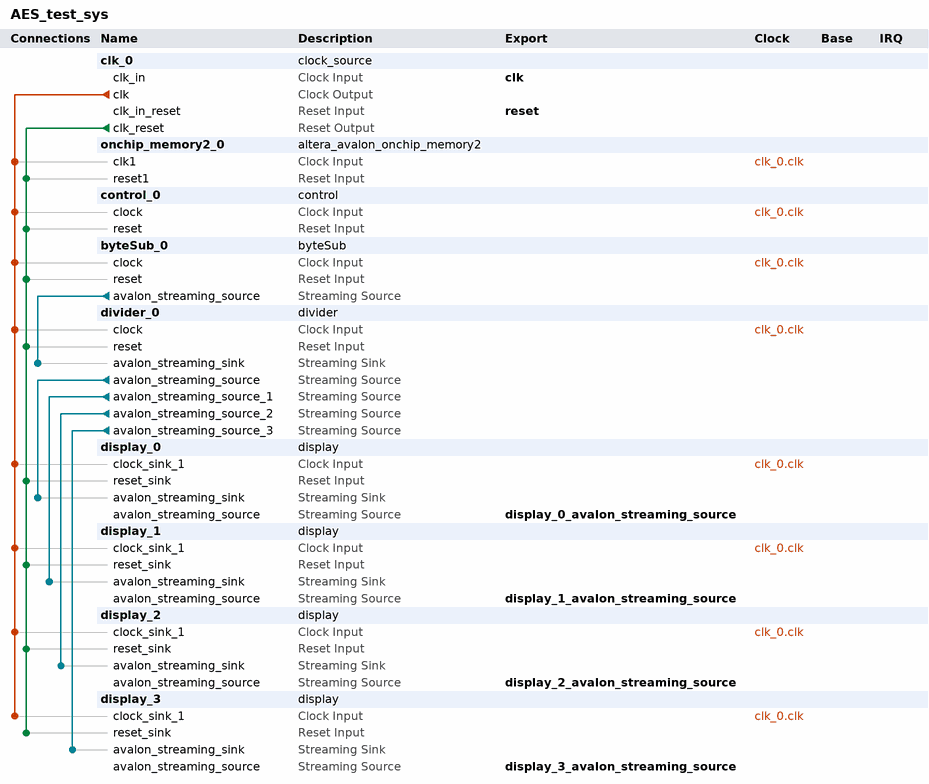
[diagram p0: system contents]
# Platform Designer (Qsys) system AES_test_sys, MAX 10 10M50DAF484C7G
# Parameters at their usual value, and those the tool derives, are not listed.
package require -exact qsys 18.0
create_system AES_test_sys
set_project_property DEVICE_FAMILY {MAX 10}
set_project_property DEVICE 10M50DAF484C7G

add_instance clk_0 clock_source 18.0
set_instance_parameter_value clk_0 clockFrequency 50000000

add_instance onchip_memory2_0 altera_avalon_onchip_memory2 18.0
set_instance_parameter_value onchip_memory2_0 dataWidth 128
set_instance_parameter_value onchip_memory2_0 dualPort false
set_instance_parameter_value onchip_memory2_0 initMemContent true
set_instance_parameter_value onchip_memory2_0 initializationFileName C:/Users/test/Desktop/GitLab/AES/init_file.hex
set_instance_parameter_value onchip_memory2_0 memorySize 1024
set_instance_parameter_value onchip_memory2_0 readDuringWriteMode OLD_DATA
set_instance_parameter_value onchip_memory2_0 singleClockOperation true
set_instance_parameter_value onchip_memory2_0 useNonDefaultInitFile true
set_instance_parameter_value onchip_memory2_0 writable false

add_instance control_0 control 1.0

add_instance byteSub_0 byteSub 1.0

add_instance divider_0 divider 1.0

add_instance display_0 display 1.0

add_instance display_1 display 1.0

add_instance display_2 display 1.0

add_instance display_3 display 1.0

# connections
add_connection clk_0.clk byteSub_0.clock clock
add_connection clk_0.clk control_0.clock clock
add_connection clk_0.clk display_0.clock_sink_1 clock
add_connection clk_0.clk display_1.clock_sink_1 clock
add_connection clk_0.clk display_2.clock_sink_1 clock
add_connection clk_0.clk display_3.clock_sink_1 clock
add_connection clk_0.clk divider_0.clock clock
add_connection clk_0.clk onchip_memory2_0.clk1 clock
add_connection clk_0.clk_reset byteSub_0.reset reset
add_connection clk_0.clk_reset control_0.reset reset
add_connection clk_0.clk_reset display_0.reset_sink reset
add_connection clk_0.clk_reset display_1.reset_sink reset
add_connection clk_0.clk_reset display_2.reset_sink reset
add_connection clk_0.clk_reset display_3.reset_sink reset
add_connection clk_0.clk_reset divider_0.reset reset
add_connection clk_0.clk_reset onchip_memory2_0.reset1 reset
add_connection byteSub_0.avalon_streaming_source divider_0.avalon_streaming_sink avalon_streaming
add_connection divider_0.avalon_streaming_source display_0.avalon_streaming_sink avalon_streaming
add_connection divider_0.avalon_streaming_source_1 display_1.avalon_streaming_sink avalon_streaming
add_connection divider_0.avalon_streaming_source_2 display_2.avalon_streaming_sink avalon_streaming
add_connection divider_0.avalon_streaming_source_3 display_3.avalon_streaming_sink avalon_streaming

# exported interfaces
add_interface clk clock sink
set_interface_property clk EXPORT_OF clk_0.clk_in
add_interface display_0_avalon_streaming_source avalon_streaming source
set_interface_property display_0_avalon_streaming_source EXPORT_OF display_0.avalon_streaming_source
add_interface display_1_avalon_streaming_source avalon_streaming source
set_interface_property display_1_avalon_streaming_source EXPORT_OF display_1.avalon_streaming_source
add_interface display_2_avalon_streaming_source avalon_streaming source
set_interface_property display_2_avalon_streaming_source EXPORT_OF display_2.avalon_streaming_source
add_interface display_3_avalon_streaming_source avalon_streaming source
set_interface_property display_3_avalon_streaming_source EXPORT_OF display_3.avalon_streaming_source
add_interface reset reset sink
set_interface_property reset EXPORT_OF clk_0.clk_in_reset

set_interconnect_requirement {$system} qsys_mm.clockCrossingAdapter HANDSHAKE
set_interconnect_requirement {$system} qsys_mm.enableEccProtection FALSE
set_interconnect_requirement {$system} qsys_mm.insertDefaultSlave FALSE
set_interconnect_requirement {$system} qsys_mm.maxAdditionalLatency 1

save_system AES_test_sys.qsys
